# Altium schematic sheet Sheet1.SchDoc
size A4
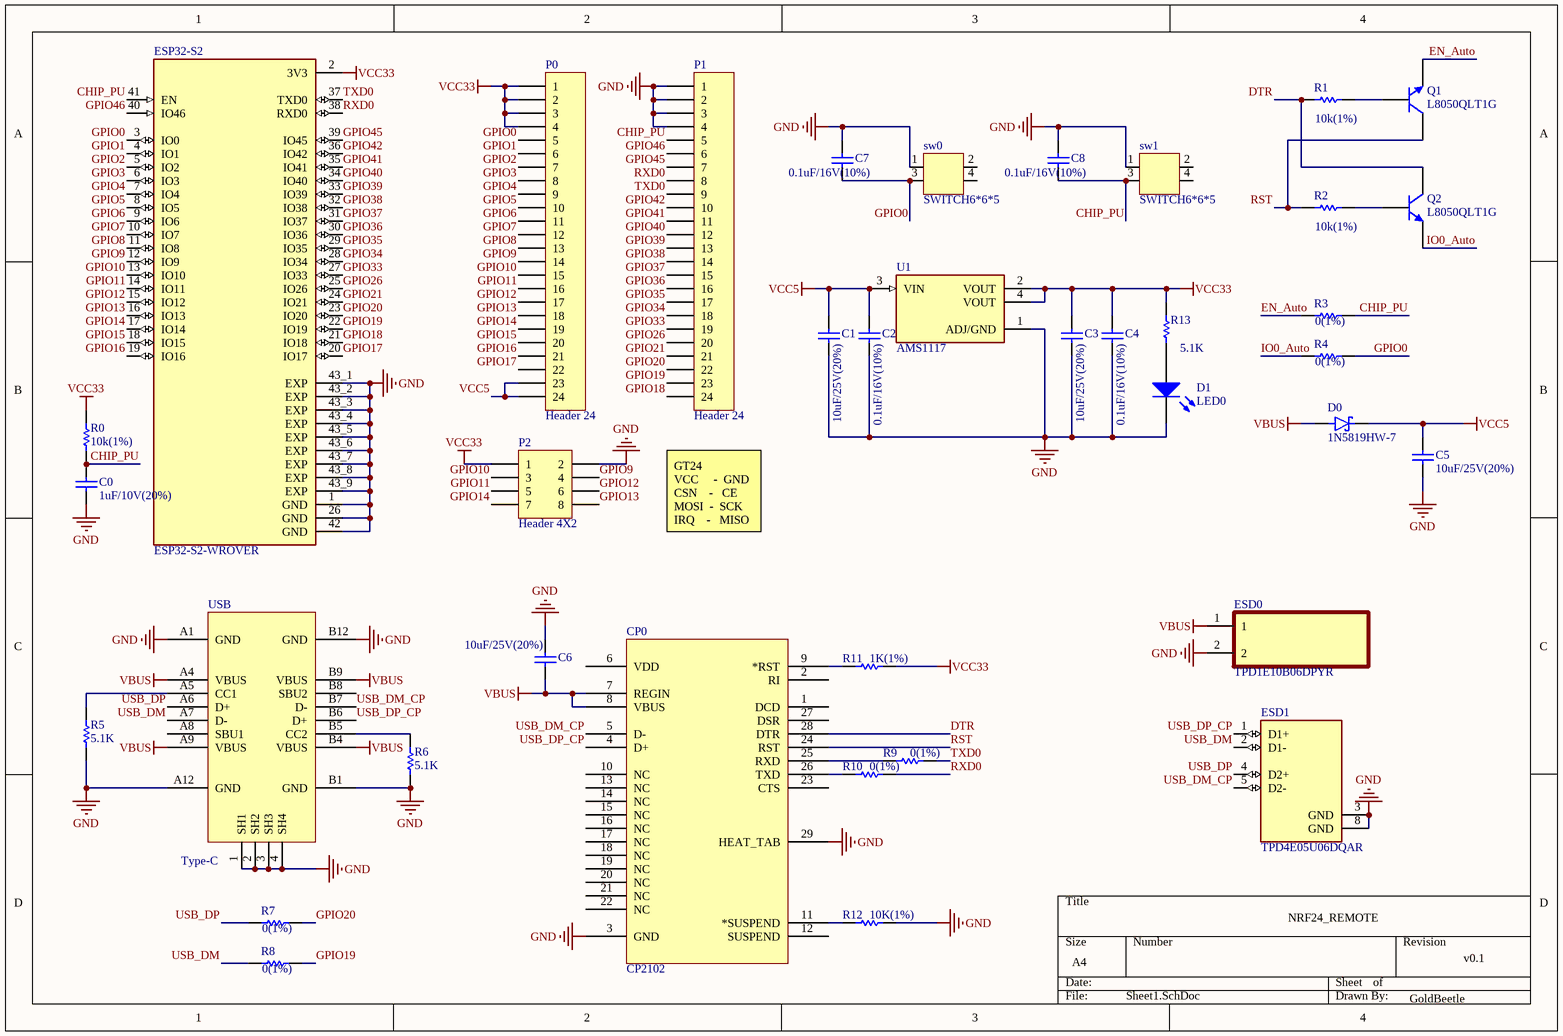
[diagram p0: Sheet1.SchDoc]

## Parts
C0  1uF/10V(20%)  [C0805]
C1  10uF/25V(20%)  [C0805]
C2  0.1uF/16V(10%)  [C0805]
C3  10uF/25V(20%)  [C0805]
C4  0.1uF/16V(10%)  [C0805]
C5  10uF/25V(20%)  [C0805]
C6  10uF/25V(20%)  [C0805]
C7  0.1uF/16V(10%)  [C0805]
C8  0.1uF/16V(10%)  [C0805]
CP0  CP2102  [QFN-28]
D0  1N5819HW-7  [SOD3715X145N]
D1  LED0  [C0805]
ESD0  TPD1E10B06DPYR  [DIO_TPD1E05U06DPYR(X1Son)]
ESD1  TPD4E05U06DQAR  [TI_TPD4E05U06DQAR(USON10)]
ESP32-S2  ESP32-S2-WROVER  [MODULE_ESP32-S2-WROVER]
P0  Header 24  [HDR1X24]
P1  Header 24  [HDR1X24]
P2  Header 4X2  [HDR2X4]
Q1  L8050QLT1G  [SOT100P237X110-3N]
Q2  L8050QLT1G  [SOT100P237X110-3N]
R0  10k(1%)  [C0805]
R1  10k(1%)  [C0805]
R2  10k(1%)  [C0805]
R3  0(1%)  [C0805]
R4  0(1%)  [C0805]
R5  5.1K  [C0805]
R6  5.1K  [C0805]
R7  0(1%)  [C0805]
R8  0(1%)  [C0805]
R9  0(1%)  [C0805]
R10  0(1%)  [C0805]
R11  1K(1%)  [C0805]
R12  10K(1%)  [C0805]
R13  5.1K  [C0805]
sw0  SWITCH6*6*5  [SWITCH6*6*5]
sw1  SWITCH6*6*5  [SWITCH6*6*5]
U1  AMS1117  [SOT229P700X180-4N]
USB  Type-C  [Type-C-TOP]

## Nets
GND: C0.1 C1.1 C2.1 C3.1 C4.1 C5.1 C6.1 C7.1 C8.1 CP0.3(GND) CP0.29(HEAT_TAB) D1.2(K) ESD0.2 ESD1.3(GND) ESD1.8(GND) ESP32-S2.1(GND) ESP32-S2.26(GND) ESP32-S2.42(GND) ESP32-S2.43_1(EXP) ESP32-S2.43_2(EXP) ESP32-S2.43_3(EXP) ESP32-S2.43_4(EXP) ESP32-S2.43_5(EXP) ESP32-S2.43_6(EXP) ESP32-S2.43_7(EXP) ESP32-S2.43_8(EXP) ESP32-S2.43_9(EXP) P1.1 P1.2 P1.3 P1.4 P2.2 R5.1 R6.1 R12.2 sw0.1 sw1.1 U1.1(ADJ/GND) USB.1(SH1) USB.2(SH2) USB.3(SH3) USB.4(SH4) USB.A1(GND) USB.A12(GND) USB.B1(GND) USB.B12(GND)
VBUS: C6.2 CP0.7(REGIN) CP0.8(VBUS) D0.A ESD0.1 USB.A4(VBUS) USB.A9(VBUS) USB.B4(VBUS) USB.B9(VBUS)
VCC5: C1.2 C2.2 C5.2 D0.C(K) P0.23 P0.24 U1.3(VIN)
VCC33: C3.2 C4.2 ESP32-S2.2(3V3) P0.1 P0.2 P0.3 P0.4 P2.1 R0.2 R11.2 R13.1 U1.2(VOUT) U1.4(VOUT)
CHIP_PU: C0.2 C8.2 ESP32-S2.41(EN) P1.5 R0.1 R3.2 sw1.3
DTR: CP0.28(DTR) Q2.3(C) R1.1
EN_Auto: Q1.1(E) R3.1
GPIO0: C7.2 ESP32-S2.3(IO0) P0.5 R4.2 sw0.3
GPIO1: ESP32-S2.4(IO1) P0.6
GPIO2: ESP32-S2.5(IO2) P0.7
GPIO3: ESP32-S2.6(IO3) P0.8
GPIO4: ESP32-S2.7(IO4) P0.9
GPIO5: ESP32-S2.8(IO5) P0.10
GPIO6: ESP32-S2.9(IO6) P0.11
GPIO7: ESP32-S2.10(IO7) P0.12
GPIO8: ESP32-S2.11(IO8) P0.13
GPIO9: ESP32-S2.12(IO9) P0.14 P2.4
GPIO10: ESP32-S2.13(IO10) P0.15 P2.3
GPIO11: ESP32-S2.14(IO11) P0.16 P2.5
GPIO12: ESP32-S2.15(IO12) P0.17 P2.6
GPIO13: ESP32-S2.16(IO13) P0.18 P2.8
GPIO14: ESP32-S2.17(IO14) P0.19 P2.7
GPIO15: ESP32-S2.18(IO15) P0.20
GPIO16: ESP32-S2.19(IO16) P0.21
GPIO17: ESP32-S2.20(IO17) P0.22
GPIO18: ESP32-S2.21(IO18) P1.24
GPIO19: ESP32-S2.22(IO19) P1.23 R8.2
GPIO20: ESP32-S2.23(IO20) P1.22 R7.2
GPIO21: ESP32-S2.24(IO21) P1.21
GPIO26: ESP32-S2.25(IO26) P1.20
GPIO33: ESP32-S2.27(IO33) P1.19
GPIO34: ESP32-S2.28(IO34) P1.18
GPIO35: ESP32-S2.29(IO35) P1.17
GPIO36: ESP32-S2.30(IO36) P1.16
GPIO37: ESP32-S2.31(IO37) P1.15
GPIO38: ESP32-S2.32(IO38) P1.14
GPIO39: ESP32-S2.33(IO39) P1.13
GPIO40: ESP32-S2.34(IO40) P1.12
GPIO41: ESP32-S2.35(IO41) P1.11
GPIO42: ESP32-S2.36(IO42) P1.10
GPIO45: ESP32-S2.39(IO45) P1.7
GPIO46: ESP32-S2.40(IO46) P1.6
IO0_Auto: Q2.1(E) R4.1
RST: CP0.24(RST) Q1.3(C) R2.1
RXD0: ESP32-S2.38(RXD0) P1.8 R10.2
TXD0: ESP32-S2.37(TXD0) P1.9 R9.2
USB_DM: ESD1.2(D1-) R8.1 USB.A7(D-)
USB_DM_CP: CP0.5(D-) ESD1.5(D2-) USB.B7(D-)
USB_DP: ESD1.4(D2+) R7.1 USB.A6(D+)
USB_DP_CP: CP0.4(D+) ESD1.1(D1+) USB.B6(D+)
NetCP0_9: CP0.9(*RST) R11.1
NetCP0_11: CP0.11(*SUSPEND) R12.1
NetCP0_25: CP0.25(RXD) R9.1
NetCP0_26: CP0.26(TXD) R10.1
NetD1_1: D1.1(A) R13.2
NetQ1_2: Q1.2(B) R1.2
NetQ2_2: Q2.2(B) R2.2
NetR5_2: R5.2 USB.A5(CC1)
NetR6_2: R6.2 USB.B5(CC2)

Not connected (* = marked no-connect by the designer): CP0 1(DCD) 2(RI) 6(VDD) 10(NC) 12(SUSPEND) 13(NC) 14(NC) 15(NC) 16(NC) 17(NC) 18(NC) 19(NC) 20(NC) 21(NC) 22(NC) 23(CTS) 27(DSR); sw0 2 4; sw1 2 4; USB A8(SBU1) B8(SBU2)

## Notes on the sheet
- GT24
  VCC     -  GND
  CSN    -   CE
  MOSI  -  SCK
  IRQ    -   MISO
- NRF24_REMOTE
- v0.1
- GoldBeetle

## Library data of the parts
C0-C8 = Cap: Capacitor; Published: 8-Jun-2000; LatestRevisionDate: 17-Jul-2002; LatestRevisionNote: Re-released for DXP Platform.; PackageReference: RAD-0.3; Publisher: Altium Limited; PackageDescription: Radial Cap, Thru-Hole; 2 Leads; 0.3 in Pin Spacing
CP0 = CP2102: USB转TTL; PART DESC: SINGLE-CHIP USB TO UART BRIDGE, QFN28, RoHS.; MFG #1: SILICON LABS; PART NUMBER: CP2102; Value: Value; RefDes: RefDes; Type: DEV
D0 = 1N5819HW-7: Diode Schottky 40 V 1A Surface Mount SOD-123; MF: Diodes Inc.; SnapEDA_Link: https://www.snapeda.com/parts/1N5819HW-7/Diodes+Inc./view-part/?ref=snap; Price: None; Check_prices: https://www.snapeda.com/parts/1N5819HW-7/Diodes+Inc./view-part/?ref=eda; Availability: In Stock; Value: *; MP: 1N5819HW-7; Package: SOD-123 Fairchild Semiconductor; Purchase-URL: https://pricing.snapeda.com/search/part/1N5819HW-7/?ref=eda
D1 = LED0: Typical INFRARED GaAs LED; Published: 8-Jun-2000; LatestRevisionDate: 08-Jul-2005; LatestRevisionNote: Mech Layer 1 removed.; PackageReference: LED-0; Publisher: Altium Limited; PackageDescription: LED; 2 Leads
ESD0 = TPD1E10B06DPYR: Single-channel ESD in 0402 package with 10pF capacitance and 6-V breakdown 2-X1SON -40 to 125; MF: Texas Instruments; MP: TPD1E10B06DPYR; Texas_Instruments-Purchase-URL: https://snapeda.com/shop?store=Texas+Instruments&id=150568; SnapEDA_Link: https://www.snapeda.com/parts/TPD1E10B06DPYR/Texas%20Instruments/view-part/150568/?ref=snap; Digi-Key_Part_Number: 296-30406-1-ND; Value: *; Package: X1SON-2 Texas Instruments
ESD1 = TPD4E05U06DQAR: 14V Clamp 2.5A _8/20Âµs_ Ipp Tvs Diode Surface Mount 10-USON _2.5x1_; MF: Texas Instruments; SnapEDA_Link: https://www.snapeda.com/parts/TPD4E05U06DQAR/Texas%20Instruments/view-part/431231/?ref=snap; MP: TPD4E05U06DQAR; Price: None; Availability: Unavailable; Value: *; Package: UFDFN-10 Texas Instruments
ESP32-S2 = ESP32-S2-WROVER: WiFi 802.11b/g/n Transceiver Module 2.4GHz PCB Trace Surface Mount; MF: Espressif Systems; Check_prices: https://www.snapeda.com/parts/ESP32-S2-WROVER/Espressif%20Systems/view-part/4614060/?ref=eda; SnapEDA_Link: https://www.snapeda.com/parts/ESP32-S2-WROVER/Espressif%20Systems/view-part/4614060/?ref=snap; Value: *; MP: ESP32-S2-WROVER; Package: None; Price: None; Availability: In Stock
P0 P1 = Header 24: Header, 24-Pin; LatestRevisionDate: 17-Jul-2002; LatestRevisionNote: Re-released for DXP Platform.; Publisher: Altium Limited
P2 = Header 4X2: Header, 4-Pin, Dual row; LatestRevisionDate: 17-Jul-2002; LatestRevisionNote: Re-released for DXP Platform.; Publisher: Altium Limited
Q1 Q2 = 2N3904: NPN General Purpose Amplifier; Published: 8-Jun-2000; LatestRevisionDate: 15-Jan-2003; LatestRevisionNote: PCB Footprint 'BCY-W3/D4.7' replaced; DatasheetVersion: 1997; PackageVersion: Sep-1998; PackageReference: TO-92A; Publisher: Altium Limited; PackageDescription: TO, Flat Index; 3 In-Line, Axial Leads; Body Dia. 4.5mm; Leads 0.51 x 0.48 mm (max); ComponentLink1Description: Manufacturer Link; ComponentLink1URL: http://www.fairchildsemi.com/; ComponentLink2Description: Datasheet; ComponentLink2URL: http://www.fairchildsemi.com/ds/2N%2F2N3904.pdf
R0-R13 = Res1: Resistor; Published: 8-Jun-2000; LatestRevisionDate: 17-Jul-2002; LatestRevisionNote: Re-released for DXP Platform.; PackageReference: AXIAL-0.3; Publisher: Altium Limited; PackageDescription: Axial Device, Thru-Hole; 2 Leads; 0.3 in Pin Spacing
U1 = AMS1117: UNO PLUS Arduino R3 Shield, Xbee Arduino IDE Wheeled Robotics Kit; MF: Seeed Technology; Availability: Unavailable; SnapEDA_Link: https://www.snapeda.com/parts/AMS1117/Seeed%20Technology%20Co.%2C%20Ltd/view-part/184428/?ref=snap; MP: AMS1117; Price: None; Value: *; Package: SOT-223 Seeed Technology
USB = USB-Type-C-TOP